# Altium schematic sheet Key Panel 030602.SchDoc
size A4; Organization: Altium Limited; Address1: L3, 12a Rodborough Rd; Address2: Frenchs Forest; Address3: NSW; Address4: Australia 2086; PageSetup: Record=PageOptions|CenterHorizontal=True|CenterVertical=True|PrintScale=0.97|XCorrection=1.00|YCorrection=1.00|PrintKind=1|BorderSize=5000000|LeftOffset=0|BottomOffset=0|Orientation=2|PaperLength=1000|PaperWidth=1000|Scale=100|PaperSource=15|PrintQuality=600|MediaType=1|DitherType=10|PrintScaleMode=1|PaperKind=A4|PaperIndex=9
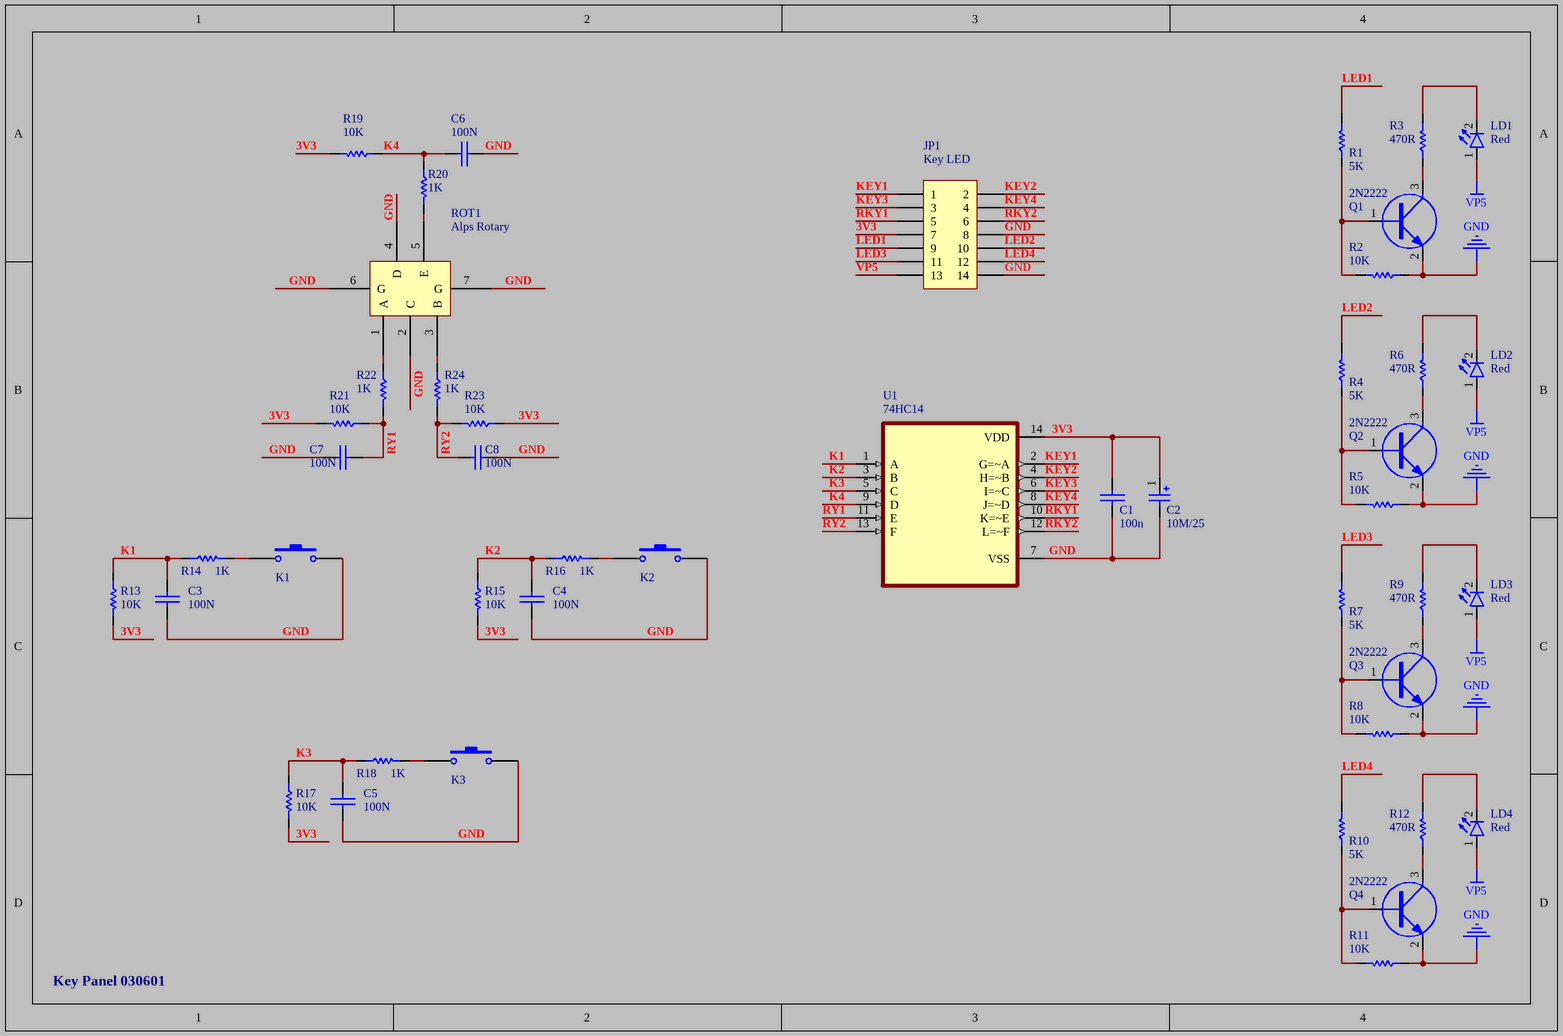
[diagram p0: Key Panel 030602.SchDoc]

## Parts
C1  100n  [SMD_CAP_1206.]
C2  10M/25  [CAP1p]
C3  100N  [SMD_CAP_1206.]
C4  100N  [SMD_CAP_1206.]
C5  100N  [SMD_CAP_1206.]
C6  100N  [SMD_CAP_1206.]
C7  100N  [SMD_CAP_1206.]
C8  100N  [SMD_CAP_1206.]
JP1  Key LED  [IDC14-BOX]
K1  Left  [SW-12*14]  (value not drawn)
K2  Left  [SW-12*14]  (value not drawn)
K3  Left  [SW-12*14]  (value not drawn)
LD1  Red  [LED3]
LD2  Red  [LED3]
LD3  Red  [LED3]
LD4  Red  [LED3]
Q1  2N2222  [2N2222]
Q2  2N2222  [2N2222]
Q3  2N2222  [2N2222]
Q4  2N2222  [2N2222]
R1  5K  [RES 1206]
R2  10K  [RES 1206]
R3  470R  [RES 1206]
R4  5K  [RES 1206]
R5  10K  [RES 1206]
R6  470R  [RES 1206]
R7  5K  [RES 1206]
R8  10K  [RES 1206]
R9  470R  [RES 1206]
R10  5K  [RES 1206]
R11  10K  [RES 1206]
R12  470R  [RES 1206]
R13  10K  [RES 1206]
R14  1K  [RES 1206]
R15  10K  [RES 1206]
R16  1K  [RES 1206]
R17  10K  [RES 1206]
R18  1K  [RES 1206]
R19  10K  [RES 1206]
R20  1K  [RES 1206]
R21  10K  [RES 1206]
R22  1K  [RES 1206]
R23  10K  [RES 1206]
R24  1K  [RES 1206]
ROT1  Alps Rotary  [EC11]
U1  74HC14  [SOIC-14PIN]

## Nets
GND: C1.1 C2.2 C3.1 C4.1 C5.1 C6.1 C7.1 C8.1 JP1.8 JP1.14 K1.2 K2.2 K3.2 Q1.2(B) Q2.2(B) Q3.2(B) Q4.2(B) R2.1 R5.1 R8.1 R11.1 ROT1.2(C) ROT1.4(D) ROT1.6(G) ROT1.7(G) U1.7(VSS)
VP5: JP1.13 LD1.1(A) LD2.1(A) LD3.1(A) LD4.1(A)
3V3: C1.2 C2.1 JP1.7 R13.2 R15.2 R17.2 R19.2 R21.2 R23.1 U1.14(VDD)
K1: C3.2 R13.1 R14.1 U1.1(A)
K2: C4.2 R15.1 R16.1 U1.3(B)
K3: C5.2 R17.1 R18.1 U1.5(C)
K4: C6.2 R19.1 R20.1 U1.9(D)
KEY1: JP1.1 U1.2(G=~A)
KEY2: JP1.2 U1.4(H=~B)
KEY3: JP1.3 U1.6(I=~C)
KEY4: JP1.4 U1.8(J=~D)
LED1: JP1.9 R1.2
LED2: JP1.10 R4.2
LED3: JP1.11 R7.2
LED4: JP1.12 R10.2
RKY1: JP1.5 U1.10(K=~E)
RKY2: JP1.6 U1.12(L=~F)
RY1: C7.2 R21.1 R22.2 U1.11(E)
RY2: C8.2 R23.2 R24.2 U1.13(F)
NetK1_1: K1.1 R14.2
NetK2_1: K2.1 R16.2
NetK3_1: K3.1 R18.2
NetLD1_2: LD1.2(K) R3.2
NetLD2_2: LD2.2(K) R6.2
NetLD3_2: LD3.2(K) R9.2
NetLD4_2: LD4.2(K) R12.2
NetQ1_1: Q1.1(E) R1.1 R2.2
NetQ1_3: Q1.3(C) R3.1
NetQ2_1: Q2.1(E) R4.1 R5.2
NetQ2_3: Q2.3(C) R6.1
NetQ3_1: Q3.1(E) R7.1 R8.2
NetQ3_3: Q3.3(C) R9.1
NetQ4_1: Q4.1(E) R10.1 R11.2
NetQ4_3: Q4.3(C) R12.1
NetR20_2: R20.2 ROT1.5(E)
NetR22_1: R22.1 ROT1.1(A)
NetR24_1: R24.1 ROT1.3(B)

## Notes on the sheet
- Key Panel 030601
- Title
- Size:
- Date:
- A4
- Number:
- Time:
- Revision:
- Sheet
- of
- File:

## Library data of the parts
C1 C3-C8 = C
C2 = Cap Pol1 _ SMD: SMD Polarized Capacitor; Published: 8-Jun-2000; LatestRevisionDate: 17-Jul-2002; LatestRevisionNote: Re-released for DXP Platform.; PackageReference: RB7.6-15; Publisher: Altium Limited; PackageDescription: Polarized Capacitor (Radial); 2 Leads
JP1 = Header 7X2: Header, 7-Pin, Dual row; LatestRevisionDate: 17-Jul-2002; LatestRevisionNote: Re-released for DXP Platform.; Publisher: Altium Limited
K1-K3 = Switch PB: Push Button Switch; Foot Print: Switch - Push to On
LD1-LD4 = LED: Designer: Saeid Jorablo; Organazation: ControTec; Adding Date: 1387/12/22; Color: Red; Size: SMD 1206
Q1-Q4 = N
R1-R24 = Resistor: Tolerance: 5%; Power: 1/8 W
  R1 R4 R7 R10: Value: 5K
  R2 R5 R8 R11: Value: 10K
  R3 R6 R9 R12: Value: 470R
  R13 R15 R17 R19 R21 R23: Value: 10K; Foot Print: RES 1206
  R14 R16 R18 R20 R22 R24: Value: 1K; Foot Print: RES 1206
ROT1 = AlpsRotary
U1 = CD40106BE: CMOS Hex Schmitt Triggers 14-PDIP -55 to 125; MF: Texas Instruments; Package: PDIP-14 Texas Instruments; Mouser-Purchase-URL: https://snapeda.com/shop?store=Mouser&id=567726; Texas_Instruments-Purchase-URL: https://snapeda.com/shop?store=Texas+Instruments&id=567726; Value: *; Price: None; DigiKey-Purchase-URL: https://snapeda.com/shop?store=DigiKey&id=567726; MP: CD40106BE; Availability: Good; SnapEDA_Link: https://www.snapeda.com/parts/CD40106BE/Texas%20Instruments/view-part/567726/?ref=snap